# EAGLE design pcb-lt3032 (EAGLE 7.4.0)
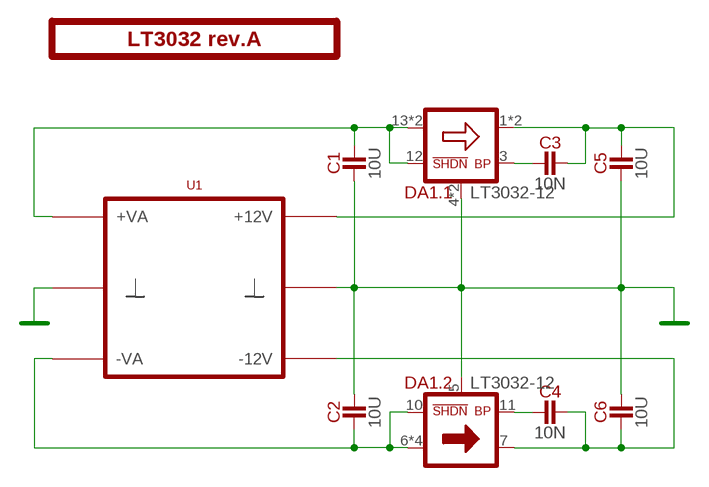
[diagram p0: schematic, sheet 1]

## Parts
C1  10U  [C-1206]
C2  10U  [C-1206]
C3  10N  [C-0805]
C4  10N  [C-0805]
C5  10U  [C-1206]
C6  10U  [C-1206]
DA1  LT3032-12  [DE14MA]
PCB1  LT3032 rev.A  GENERIC-LOGO  [F-LOGO]
U1  F-DUAL-SUPPLY-BOARD  [F-DIP8-HEATSINK-NOSILK]

## Nets
BYPN: C4.1 DA1.11(.2:BYP)
BYPP: C3.1 DA1.3(.1:BYP)
GND: C1.1 C2.2 C5.1 C6.2 DA1.4(.1:GND) DA1.5(.2:GND) DA1.15(.1:GND) U1.2(GND1) U1.3(GND1) U1.6(GND) U1.7(GND) U1.P$1(GND)
INN: C2.1 DA1.6(.2:IN) DA1.8(.2:IN) DA1.9(.2:IN) DA1.10(.2:!SHDN) DA1.16(.2:IN) U1.4(P-VA)
INP: C1.2 DA1.12(.1:!SHDN) DA1.13(.1:IN) DA1.14(.1:IN) U1.1(P+VA)
OUTN: C4.2 C6.1 DA1.7(.2:OUT) U1.5(P-12V)
OUTP: C3.2 C5.2 DA1.1(.1:OUT) DA1.2(.1:OUT) U1.8(P+12V)

## Library data of the parts
C1-C6 = capacitors:?
DA1 = regulators-linear:LT3032
PCB1 = module-footprints:GENERIC
U1 = module-footprints:F-DUAL-SUPPLY

## Board
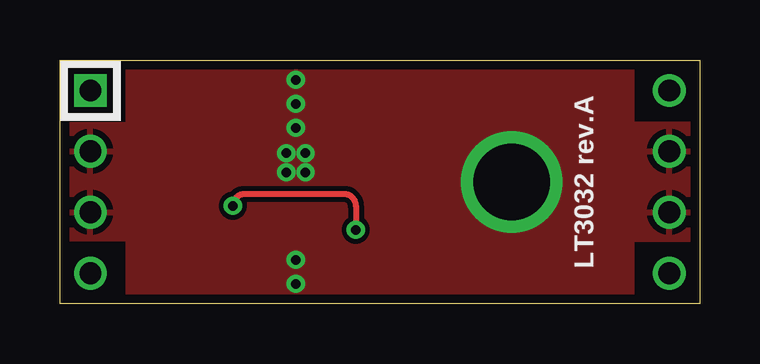
[diagram p1: board, top side]
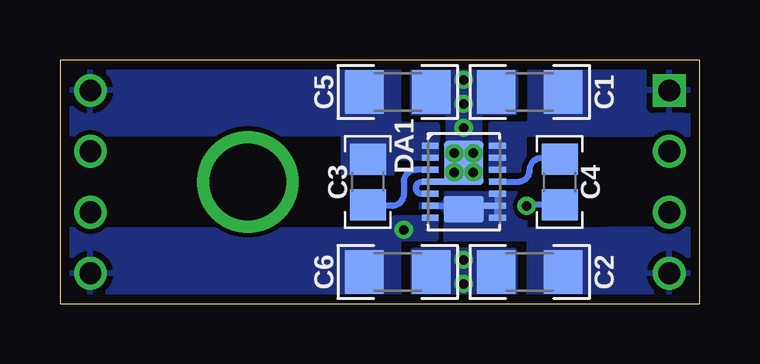
[diagram p2: board, bottom side, seen from below]

Size 26.67 x 10.16 mm. Coordinates in mm from the lower left corner, seen from the top.
Copper layers (1*16): Top 0.0356mm / dielectric 1.5011mm / Bottom 0.0356mm
Design rules "fluorumlabs": minimum track width 6mil, minimum drill 13mil, track to track 8mil, track to pad 8mil, pad to pad 6mil, via to via 6mil, smd to smd 6mil, copper to edge 15mil, drill to drill 6mil, minimum pad ring 7mil, minimum via ring 7mil, stop-mask expansion 3mil, vias tented up to drill 25mil, thermal gap 10mil

### Footprints (pad centres in the part's own frame; a part is rotated, then mirrored left to right if it is on the bottom)
C-1206 = smd 1.6 x 1.8: 1 -1.4,0; 2 1.4,0
C-0805 = smd 1.3 x 1.5: 1 -0.95,0; 2 0.95,0
DE14MA = smd 0.25 x 0.7: 1 -1.5,-1.4; 2 -1,-1.4; 3 -0.5,-1.4; 5 0.5,-1.4; 6 1,-1.4; 7 1.5,-1.4; 8 1.5,1.4; 10 0.5,1.4; 11 0,1.4; 12 -0.5,1.4; 13 -1,1.4; 14 -1.5,1.4 | smd 0.25 x 1.5: 4 0,-1; 9 1,1 | smd 1.83 x 1.65: 15 -0.79,0 | smd 1.1 x 1.65: 16 1.145,0
F-DIP8-HEATSINK-NOSILK = drill 0.914 square: 1 -3.81,-12.065 | drill 0.914: 2 -1.27,-12.065; 3 1.27,-12.065; 4 3.81,-12.065; 5 3.81,12.065; 6 1.27,12.065; 7 -1.27,12.065; 8 -3.81,12.065 | drill 3.2: P$1 0,5.5

### Placement (x,y rotation side)
C1  7.09,8.83 0 bottom
C2  7.09,1.33 180 bottom
C3  13.84,5.08 90 bottom
C4  5.84,5.08 270 bottom
C5  12.59,8.83 180 bottom
C6  12.59,1.33 0 bottom
DA1  9.84,5.08 270 bottom
PCB1  21.84,5.08 90 top
U1  13.34,5.08 270 top

### Tracks (layer width: path | path; a pad name or v marks a point on that pad's centre or on a via)
BYPN
  Bottom 0.254: DA1.11 7.59,5.08 arc-90 7.09,5.58 arc90 6.59,6.08 5.89,6.08 C4.1
BYPP
  Bottom 0.254: DA1.3 11.84,5.58 arc-90 12.34,5.08 12.34,4.58 arc90 12.84,4.08 13.79,4.08 C3.1
GND  (via drill 0.4)
  Bottom 0.254: DA1.5 11.59,4.58 arc90 11.84,4.83 arc90 11.59,5.08 DA1.4 10.24,5.08 v10.24,5.48
  other vias: 9.44,6.28 10.24,6.28 9.44,5.48 9.84,9.33 9.84,8.33 9.84,0.83 9.84,7.33 9.84,1.83
  pour Bottom (no thermals): 7.71,10.08 7.71,7.96 9.21,7.96 9.21,6.71 9.21,5.08 10.46,5.08 10.46,7.96 11.96,7.96 11.96,10.08
  pour Bottom (no thermals): 7.71,0.08 7.71,2.21 11.96,2.21 11.96,0.08
  pour Top (no thermals): 23.84,0.08 23.84,10.08 2.84,10.08 2.84,0.08
  pour Top: 26.84,7.46 22.84,7.46 22.84,2.71 26.84,2.71
  pour Top: -0.16,7.46 3.84,7.46 3.84,2.71 -0.16,2.71
INN
  Bottom 0.254: DA1.8 8.44,4.08 | DA1.10 8.44,4.08 | 8.44,4.08 DA1.9 | DA1.6 9.84,4.08 DA1.16
  pour Bottom (rank 2, no thermals): 2.84,0.08 7.09,0.08 7.09,2.71 11.59,2.71 11.59,4.58 7.34,4.58 7.34,3.08 2.84,3.08
  pour Bottom: -0.16,3.08 3.84,3.08 3.84,0.08 -0.16,0.08
INP
  pour Bottom (no thermals): 2.84,10.08 7.09,10.08 7.09,7.46 8.71,7.46 8.71,5.58 7.34,5.58 7.34,7.08 2.84,7.08
  pour Bottom: -0.16,10.08 3.84,10.08 3.84,7.08 -0.16,7.08
OUTN  (via drill 0.4)
  Top 0.254: v7.21,4.08 arc-90 7.71,4.58 11.84,4.58 arc-90 12.34,4.08 v12.34,3.08
  Bottom 0.254: C4.2 7.04,4.13 v7.21,4.08
  pour Bottom (no thermals): 23.84,0.08 23.84,3.08 12.71,3.08 12.71,3.58 11.02,3.58 11.02,2.71 12.59,2.71 12.59,0.08
  pour Bottom: 26.84,0.08 26.84,3.08 22.34,3.08 22.34,0.08
OUTP
  pour Bottom (no thermals): 23.84,10.08 12.59,10.08 12.59,7.46 10.96,7.46 10.96,6.08 12.84,6.08 12.84,5.46 14.84,5.46 14.84,7.08 23.84,7.08
  pour Bottom: 26.84,10.08 22.34,10.08 22.34,7.08 26.84,7.08